# EAGLE design rpi-i2c (EAGLE 9.2.0)
AUTHOR: Adam Horcica; TITLE: RPI I2C Mini Hat; VERSION: 1
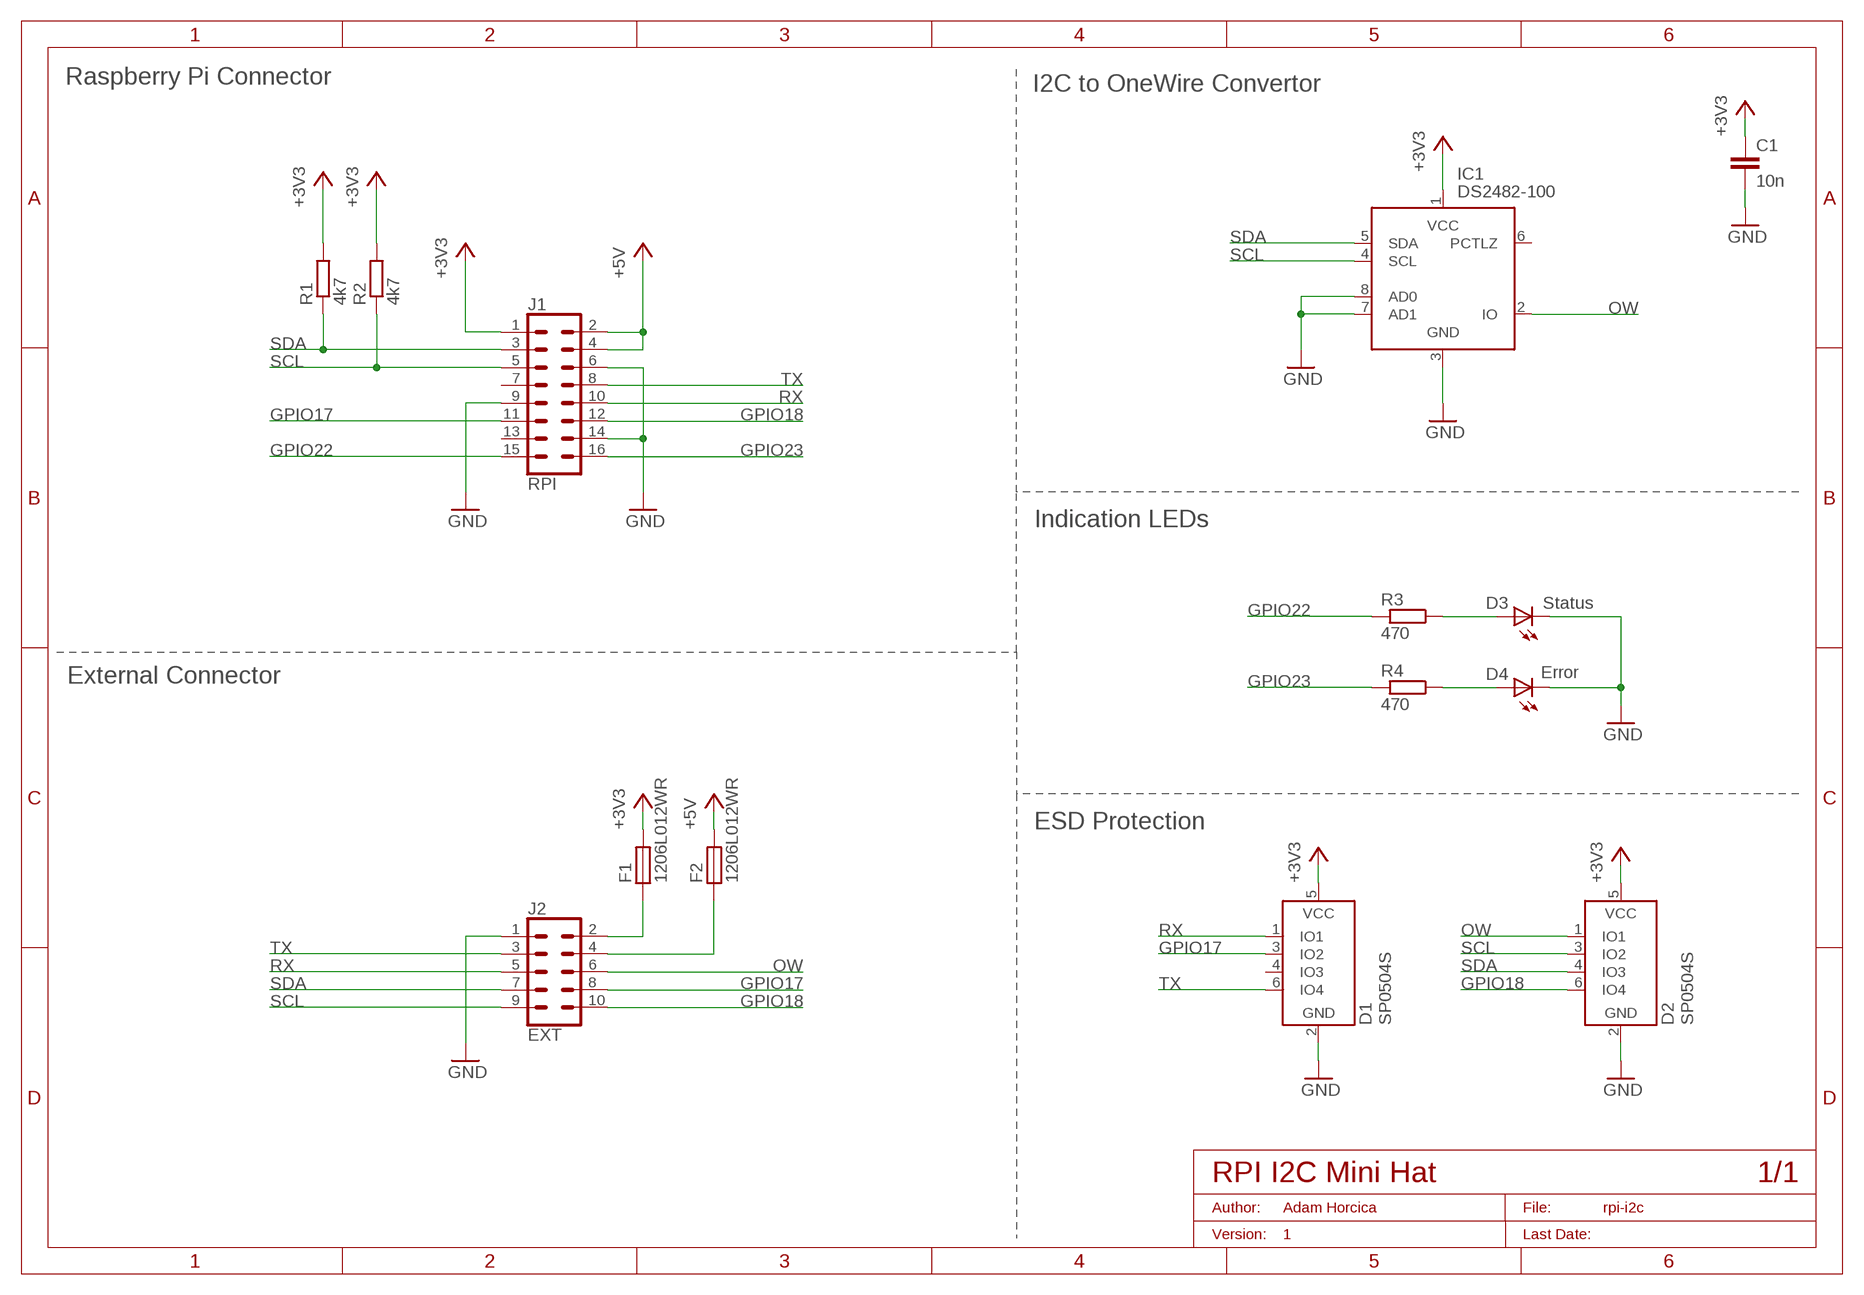
[diagram p0: schematic, sheet 1]

## Parts
C1  10n  C-EUC0805  [C0805]
D1  SP0504S  [SOT23-6]
D2  SP0504S  [SOT23-6]
D3  LEDCHIPLED_0805  [CHIPLED_0805]
D4  LEDCHIPLED_0805  [CHIPLED_0805]
F1  1206L012WR  PTC1206L075/13.2WR  [C1206K]
F2  1206L012WR  PTC1206L075/13.2WR  [C1206K]
IC1  DS2482-100  [SO08]
J1  RPI  CONN_08X2I  [2X8-INVERSE]
J2  EXT  CONN_05X2  [30310-5002HB]
R1  4k7  R-EU_R0603  [R0603]
R2  4k7  R-EU_R0603  [R0603]
R3  470  R-EU_R0603  [R0603]
R4  470  R-EU_R0603  [R0603]

## Nets
3V3F: F1.1 J2.2
5V0F: F2.1 J2.4
+3V3: C1.1 D1.5(VCC) D2.5(VCC) F1.2 IC1.1(VCC) J1.1 R1.2 R2.2
+5V: F2.2 J1.2 J1.4
GND: C1.2 D1.2(GND) D2.2(GND) D3.C D4.C IC1.3(GND) IC1.7(AD1) IC1.8(AD0) J1.6 J1.9 J1.14 J2.1
GPIO17: D1.3(IO2) J1.11 J2.8
GPIO18: D2.6(IO4) J1.12 J2.10
GPIO22: J1.15 R3.2
GPIO23: J1.16 R4.2
N$7: D3.A R3.1
N$8: D4.A R4.1
OW: D2.1(IO1) IC1.2(IO) J2.6
RX: D1.1(IO1) J1.10 J2.5
SCL: D2.3(IO2) IC1.4(SCL) J1.5 J2.9 R2.1
SDA: D2.4(IO3) IC1.5(SDA) J1.3 J2.7 R1.1
TX: D1.6(IO4) J1.8 J2.3
Unconnected: D1.4(IO3) IC1.6(PCTLZ) J1.7 J1.13

## Notes on the sheet
- Raspberry Pi Connector | I2C to OneWire Convertor
- Indication LEDs
- Status
- Error
- External Connector
- ESD Protection

## Library data of the parts
C1 = rcl:C-EU: CAPACITOR, European symbol; SPICEPREFIX: C
D1 D2 = conn:SP0504S
D3 D4 = led:LED: LED OSRAM: - CHIPLED LG R971, LG N971, LY N971, LG Q971, LY Q971, LO R971, LY R971 LH N974, LH R974 LS Q976, LO Q976, LY Q976 LO Q996 - Hyper CHIPLED LW Q18S LB Q993, LB Q99A, LB R99A - SideLED LS A670, LO A670, LY A670, LG A670, LP A670 LB A673, LV A673, LT A673, LW A673 LH A674 LY A675 LS A676, LA A676, LO A676, LY A676, LW A676 LS A679, LY A679, LG A679 - Hyper Micro SIDELED® LS Y876, LA Y876, LO Y876, LY Y876 LT Y87S - SmartLED LW L88C, LW L88S LB L89C, LB L89S, LG L890 LS L89K, LO L89K, LY L89K LS L896, LA L896, LO L896, LY L896 - TOPLED LS T670, LO T670, LY T670, LG T670, LP T670 LSG T670, LSP T670, LSY T670, LOP T670, LYG T670 LG T671, LOG T671, LSG T671 LB T673, LV T673, LT T673, LW T673 LH T674 LS T676, LA T676, LO T676, LY T676, LB T676, LH T676, LSB T676, LW T676 LB T67C, LV T67C, LT T67C, LS T67K, LO T67K, LY T67K, LW E67C LS E67B, LA E67B, LO E67B, LY E67B, LB E67C, LV E67C, LT E67C LW T67C LS T679, LY T679, LG T679 LS T770, LO T770, LY T770, LG T770, LP T770 LB T773, LV T773, LT T773, LW T773 LH T774 LS E675, LA E675, LY E675, LS T675 LS T776, LA T776, LO T776, LY T776, LB T776 LHGB T686 LT T68C, LB T68C - Hyper Mini TOPLED® LB M676 - Mini TOPLED Santana® LG M470 LS M47K, LO M47K, LY M47K Source: http://www.osram.convergy.de LUXEON: - LUMILED® LXK2-PW12-R00, LXK2-PW12-S00, LXK2-PW14-U00, LXK2-PW14-V00 LXK2-PM12-R00, LXK2-PM12-S00, LXK2-PM14-U00 LXK2-PE12-Q00, LXK2-PE12-R00, LXK2-PE12-S00, LXK2-PE14-T00, LXK2-PE14-U00 LXK2-PB12-K00, LXK2-PB12-L00, LXK2-PB12-M00, LXK2-PB14-N00, LXK2-PB14-P00, LXK2-PB14-Q00 LXK2-PR12-L00, LXK2-PR12-M00, LXK2-PR14-Q00, LXK2-PR14-R00 LXK2-PD12-Q00, LXK2-PD12-R00, LXK2-PD12-S00 LXK2-PH12-R00, LXK2-PH12-S00 LXK2-PL12-P00, LXK2-PL12-Q00, LXK2-PL12-R00 Source: www.luxeon.com KINGBRIGHT: KA-3528ASYC Source: www.kingbright.com
F1 F2 = conn:PTC; OC_FARNELL: 1596988
IC1 = conn:DS2482
J1 = conn:CONN_08X2: Multi connection point. Often used as Generic Header-pin footprint for 0.1 inch spaced/style header connections You can populate with any combo of single row headers, but if you'd like an exact match, check this: Header - 2x8 (Male, 0.1") <https://www.sparkfun.com/products/13156> (PRT-13156) On any of the 0.1 inch spaced packages, you can populate with these: Break Away Headers - Straight <https://www.sparkfun.com/products/116> (PRT-00116) Break Away Male Headers - Right Angle <https://www.sparkfun.com/products/553> (PRT-00553) Female Headers <https://www.sparkfun.com/products/115> (PRT-00115) Break Away Headers - Machine Pin <https://www.sparkfun.com/products/117> (PRT-00117) Break Away Female Headers - Swiss Machine Pin <https://www.sparkfun.com/products/743> (PRT-00743)
J2 = conn:CONN_05X2
R1-R4 = rcl:R-EU_: RESISTOR, European symbol; SPICEPREFIX: R

## Board
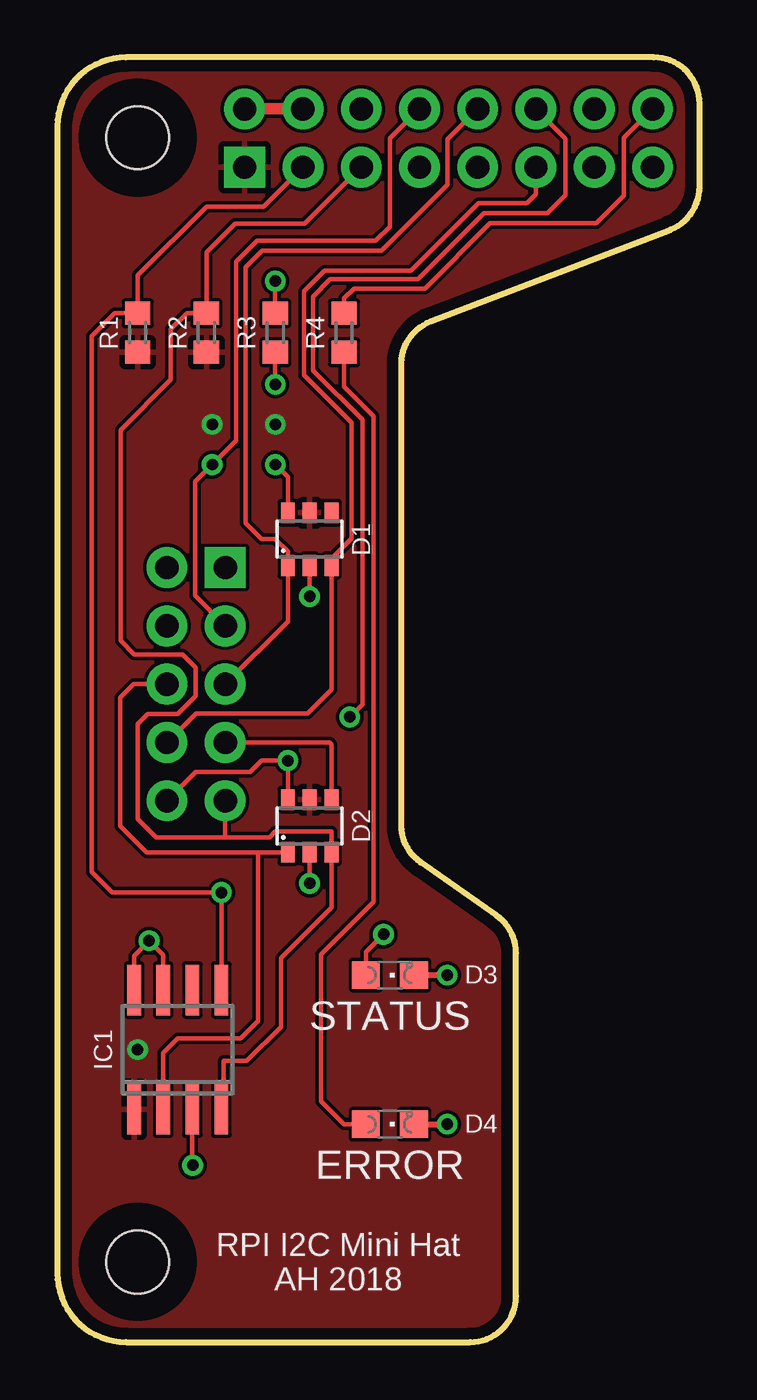
[diagram p1: board, top side]
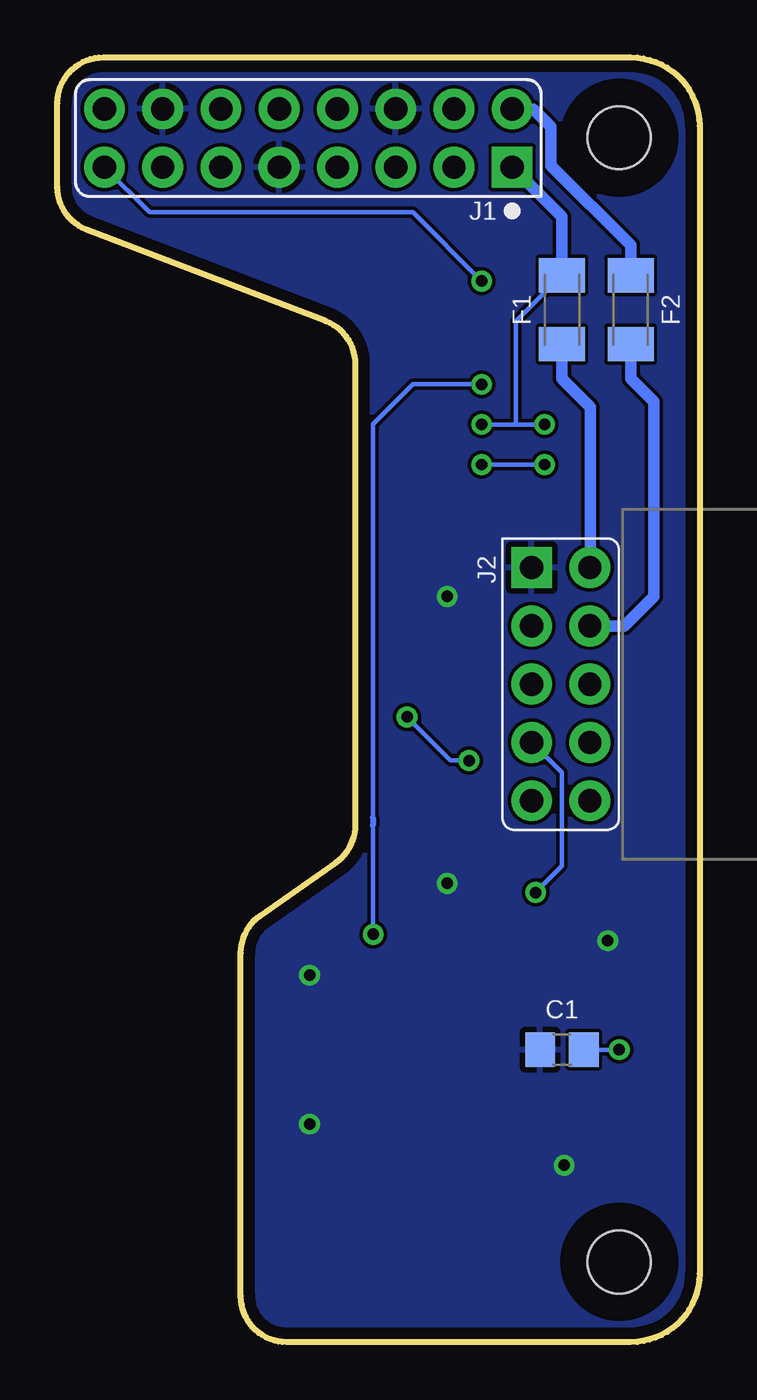
[diagram p2: board, bottom side, seen from below]

Size 28 x 56 mm. Coordinates in mm from the lower left corner, seen from the top.
Outline: 0,53 0,3 arc90 3,0 18,0 arc90 20,2 20,16.96 arc55 19.15,18.6 15.85,20.9 arc-55 15,22.54 15,42.62 arc-69 16.29,44.49 26.74,48.5 arc68 28,50.35 28,54 arc90 26,56 3,56 arc90 0,53
Copper layers (1*16): Top 0.035mm / dielectric 1.5mm / Bottom 0.035mm
Design rules "default *": minimum track width 6mil, minimum drill 0.35mm, track to track 6mil, track to pad 6mil, pad to pad 6mil, via to via 6mil, smd to smd 6mil, copper to edge 20mil, drill to drill 6mil, minimum pad ring 10mil, minimum via ring 8mil, stop-mask expansion 4mil, vias tented up to drill 0.6mm, thermal gap 10mil
Holes 2.75 mm at 3.5,3.5 3.5,52.5
tRestrict: area 1,50 to 6,55; area 1,1 to 6,6
bRestrict: area 1,50 to 6,55; area 1,1 to 6,6

### Footprints (pad centres in the part's own frame; a part is rotated, then mirrored left to right if it is on the bottom)
C0805 = smd 1.3 x 1.5: 1 -0.95,0; 2 0.95,0
SOT23-6 = smd 0.6 x 0.9: 1 -0.95,-1.15; 2 0,-1.15; 3 0.95,-1.15; 4 0.95,1.15; 5 0,1.15; 6 -0.95,1.15
CHIPLED_0805 = smd 1.2 x 1.2: A 0,-1.05; C 0,1.05
C1206K = smd 1.5 x 2: 1 -1.5,0; 2 1.5,0
SO08 = smd 0.6 x 2.2: 1 -1.905,-2.6; 2 -0.635,-2.6; 3 0.635,-2.6; 4 1.905,-2.6; 5 1.905,2.6; 6 0.635,2.6; 7 -0.635,2.6; 8 -1.905,2.6
2X8-INVERSE = drill 1.016 pad 1.778 square: 1 0,2.54 | drill 1.016 pad 1.778: 2 0,0; 3 2.54,2.54; 4 2.54,0; 5 5.08,2.54; 6 5.08,0; 7 7.62,2.54; 8 7.62,0; 9 10.16,2.54; 10 10.16,0; 11 12.7,2.54; 12 12.7,0; 13 15.24,2.54; 14 15.24,0; 15 17.78,2.54; 16 17.78,0
30310-5002HB = drill 1.016 pad 1.778 square: 1 0,-2.54 | drill 1.016 pad 1.778: 2 0,0; 3 2.54,-2.54; 4 2.54,0; 5 5.08,-2.54; 6 5.08,0; 7 7.62,-2.54; 8 7.62,0; 9 10.16,-2.54; 10 10.16,0
R0603 = smd 1 x 1.1: 1 -0.85,0; 2 0.85,0

### Placement (x,y rotation side)
C1  6,12.75 180 bottom
D1  11,35 0 top
D2  11,22.5 0 top
D3  14.5,16 270 top
D4  14.5,9.5 270 top
F1  6,45 90 bottom
F2  3,45 90 bottom
IC1  5.25,12.75 0 top
J1  8.17,53.75 180 bottom
J2  4.78,33.76 270 bottom
R1  3.5,44 270 top
R2  6.5,44 270 top
R3  9.5,44 90 top
R4  12.5,44 90 top

### Tracks (layer width: path | path; a pad name or v marks a point on that pad's centre or on a via)
3V3F
  Bottom 0.508: F1.1 6,42 4.75,40.75 4.75,33.76 J2.2
5V0F
  Bottom 0.508: F2.1 3,42 2,41 2,32.5 3.28,31.22 J2.4
+3V3  (via drill 0.5)
  Bottom 0.203: v9.5,40 8,40 | 8,40 v6.75,40 | F1.2 8,44.5 8,40 | C1.1 v3.5,12.75
  Bottom 0.508: J1.1 6,49.05 F1.2
  pour Top: -5,57 33.25,57 33.25,-2 -5,-2
+5V
  Top 0.508: J1.4 J1.2
  Bottom 0.508: F2.2 3,47.81 6.47,51.29 6.47,52.97 7.25,53.75 J1.2
GND  (via drill 0.5)
  Top 0.203: D2.2 v11,20 | IC1.3 5.88,7.72 v5.9,7.71 | IC1.8 3.35,16.84 v4,17.5 4.62,16.89 IC1.7 | D1.2 v11,32.5
  Top 0.254: D3.C v17,16 | D4.C v17,9.5
  pour Bottom: -3,58 31,58 31,-3 -3,-3
GPIO17
  Top 0.203: J2.8 6.04,27.4 10.9,27.4 11.95,28.45 D1.3 11.95,34.15 12.82,35.02 12.82,40.08 10.75,42.15 10.75,45.8 11.65,46.7 15.43,46.7 18.37,49.64 20.47,49.64 20.87,50.04 J1.11
GPIO18  (via drill 0.5)
  Top 0.203: J2.10 6.03,24.85 8.4,24.85 8.9,25.35 v10.05,25.35 D2.6 | v12.75,27.25 13.3,27.8 13.3,40.2 11.15,42.35 11.15,45.57 11.9,46.33 15.72,46.33 18.6,49.2 21.38,49.2 22.16,49.99 22.16,52.46 J1.12
  Bottom 0.203: v10.05,25.35 10.85,25.35 v12.75,27.25
GPIO22  (via drill 0.5)
  Top 0.203: R3.2 v9.5,46.25
  Bottom 0.203: J1.15 23.98,49.25 12.5,49.25 v9.5,46.25
GPIO23
  Top 0.203: J1.16 24.69,52.5 24.69,49.97 23.5,48.77 18.87,48.77 16.02,45.92 12.93,45.92 12.5,45.5 R4.2
N$7  (via drill 0.5)
  Top 0.203: R3.1 v9.5,41.75 | v14.22,17.77 13.45,17 D3.A
  Bottom 0.203: v9.5,41.75 12.5,41.75 14.24,40.01 14.24,22.86 | v14.22,17.77 14.24,18.34 14.24,22.53
  Bottom 0.254: 14.24,22.86 | 14.24,22.86 14.24,22.53
N$8
  Top 0.203: R4.1 12.5,41.65 13.79,40.36 13.79,19.18 11.5,16.89 11.5,10.5 12.5,9.5 D4.A
OW
  Top 0.203: IC1.2 4.62,12.62 5.25,13.25 8,13.25 8.75,14 8.75,21.35 | 8.75,21.35 9.5,21.35 D2.1 | 8.75,21.35 3.9,21.35 2.75,22.5 2.75,28.1 3.33,28.68 J2.6
RX
  Top 0.203: J1.10 17,52.43 17,50.45 14.12,47.58 8.93,47.58 8.2,46.85 8.2,35.7 8.9,35 9.5,35 10.05,34.45 D1.1 10.05,31.41 J2.5
SCL
  Top 0.203: J1.5 10.78,48.75 7.75,48.75 6.5,47.5 R2.1 5.65,44.85 4.95,44.15 4.95,41.95 2.75,39.75 2.75,30.58 3.35,29.97 5.45,29.97 6.02,29.4 6.02,28.16 5.25,27.39 3.94,27.39 3.5,26.95 3.5,22.8 4.3,22 7.25,22 | IC1.4 7.25,10.74 7.25,12.25 8.25,12.25 9.75,13.75 9.75,16.75 11.95,18.95 D2.3 11.95,22.25 9.5,22.25 9.25,22 7.25,22 | J2.9 7.32,22.07 7.25,22
SDA  (via drill 0.5)
  Top 0.203: J1.3 8.99,49.5 6.5,49.5 3.5,46.5 R1.1 2.5,44.85 1.5,43.85 1.5,38.25 1.5,20.5 2.4,19.6 v7.15,19.6 v7.16,19.59 IC1.5 | J2.7 11.86,26.14 11.95,26.05 D2.4
  Bottom 0.203: J2.7 6,24.82 6,20.75 v7.15,19.6
TX  (via drill 0.5)
  Top 0.203: J1.8 14.5,52.47 14.5,48.62 13.88,48 8.7,48 7.8,47.1 7.8,39.3 v6.75,38.25 6,37.5 6,32.54 J2.3 | v9.5,38.25 10.05,37.7 D1.6
  Bottom 0.203: v9.5,38.25 v6.75,38.25

### Text on the board
tNames: STATUS | ERROR | RPI I2C Mini Hat | AH 2018